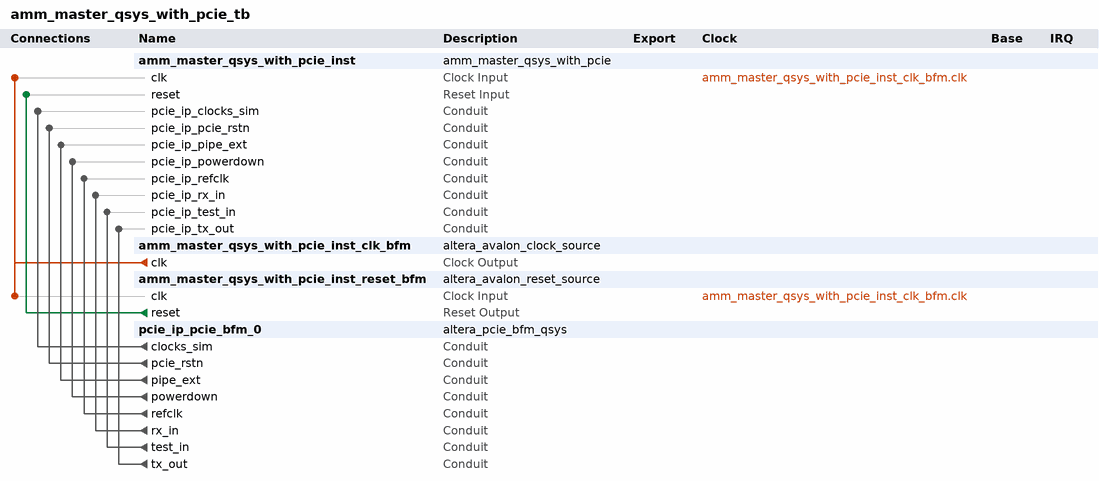
[diagram p0: system contents]
# Platform Designer (Qsys) system amm_master_qsys_with_pcie_tb, Cyclone IV GX EP4CGX150DF31C7
# Parameters at their usual value, and those the tool derives, are not listed.
package require -exact qsys 13.0
create_system amm_master_qsys_with_pcie_tb
set_project_property DEVICE_FAMILY {Cyclone IV GX}
set_project_property DEVICE EP4CGX150DF31C7

add_instance amm_master_qsys_with_pcie_inst amm_master_qsys_with_pcie 1.0

add_instance amm_master_qsys_with_pcie_inst_clk_bfm altera_avalon_clock_source 13.0

add_instance amm_master_qsys_with_pcie_inst_reset_bfm altera_avalon_reset_source 13.0
set_instance_parameter_value amm_master_qsys_with_pcie_inst_reset_bfm ASSERT_HIGH_RESET 0
set_instance_parameter_value amm_master_qsys_with_pcie_inst_reset_bfm INITIAL_RESET_CYCLES 50

add_instance pcie_ip_pcie_bfm_0 altera_pcie_bfm_qsys 13.0
set_instance_parameter_value pcie_ip_pcie_bfm_0 LINK_WIDTH 1
set_instance_parameter_value pcie_ip_pcie_bfm_0 TEST_OUT_WIDTH None

# connections
add_connection amm_master_qsys_with_pcie_inst_clk_bfm.clk amm_master_qsys_with_pcie_inst.clk clock
add_connection amm_master_qsys_with_pcie_inst_clk_bfm.clk amm_master_qsys_with_pcie_inst_reset_bfm.clk clock
add_connection amm_master_qsys_with_pcie_inst_reset_bfm.reset amm_master_qsys_with_pcie_inst.reset reset
add_connection pcie_ip_pcie_bfm_0.clocks_sim amm_master_qsys_with_pcie_inst.pcie_ip_clocks_sim conduit
add_connection pcie_ip_pcie_bfm_0.pcie_rstn amm_master_qsys_with_pcie_inst.pcie_ip_pcie_rstn conduit
add_connection pcie_ip_pcie_bfm_0.pipe_ext amm_master_qsys_with_pcie_inst.pcie_ip_pipe_ext conduit
add_connection pcie_ip_pcie_bfm_0.powerdown amm_master_qsys_with_pcie_inst.pcie_ip_powerdown conduit
add_connection pcie_ip_pcie_bfm_0.refclk amm_master_qsys_with_pcie_inst.pcie_ip_refclk conduit
add_connection pcie_ip_pcie_bfm_0.rx_in amm_master_qsys_with_pcie_inst.pcie_ip_rx_in conduit
add_connection pcie_ip_pcie_bfm_0.test_in amm_master_qsys_with_pcie_inst.pcie_ip_test_in conduit
add_connection pcie_ip_pcie_bfm_0.tx_out amm_master_qsys_with_pcie_inst.pcie_ip_tx_out conduit

set_interconnect_requirement {$system} qsys_mm.clockCrossingAdapter HANDSHAKE
set_interconnect_requirement {$system} qsys_mm.maxAdditionalLatency 1

save_system amm_master_qsys_with_pcie_tb.qsys
